# Altium project PCB_Project1.PrjPCB
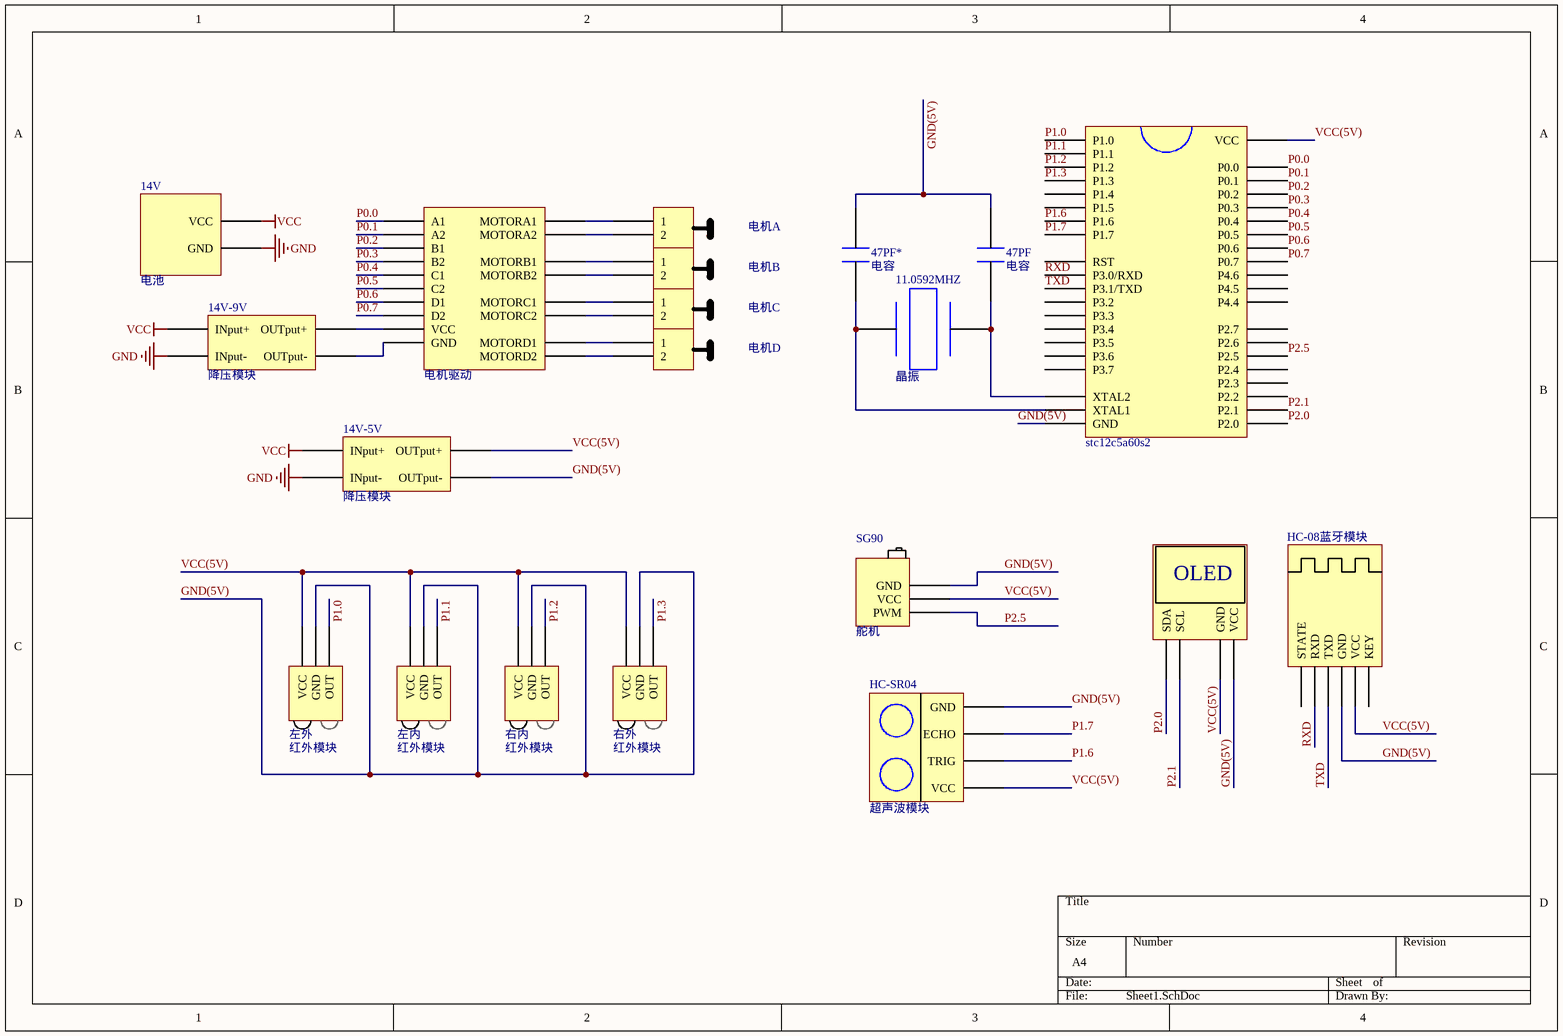
[diagram p0: Sheet1.SchDoc]
1 sheet, 20 parts. Net scope: global (net labels, ports and power ports of the same name join across sheets).

## Sheet Sheet1.SchDoc
size A4

### Parts
1  电机  (value not drawn)
2  电机  (value not drawn)
3  电机  (value not drawn)
4  电机  (value not drawn)
11.0592MHZ  晶振
14V  电池
14V-5V  降压模块
14V-9V  降压模块
47PF  电容
47PF*  电容
123412  电机驱动
HC-08蓝牙模块  蓝牙模块  (value not drawn)
HC-SR04  超声波模块
OLED  OLED显示屏  (value not drawn)
SG90  舵机
单片机  stc12c5a60s2
右内  红外模块
右外  红外模块
左内  红外模块
左外  红外模块

### Nets
GND: 14V.?2(GND) 14V-5V.?4(INput-) 14V-9V.?4(INput-)
VCC: 14V.?1(VCC) 14V-5V.?3(INput+) 14V-9V.?3(INput+)
GND(5V): 14V-5V.?2(OUTput-) 47PF.1 47PF*.1 HC-08蓝牙模块.?3(GND) HC-SR04.?4(GND) OLED.?3(VCC) SG90.?3(GND) 单片机.20(GND) 右内.?2(GND) 右外.?2(GND) 左内.?2(GND) 左外.?2(GND)
P0.0: 123412.?1(A1) 单片机.1(P0.0)
P0.1: 123412.?2(A2) 单片机.2(P0.1)
P0.2: 123412.?3(B1) 单片机.3(P0.2)
P0.3: 123412.?4(B2) 单片机.4(P0.3)
P0.4: 123412.?5(C1) 单片机.5(P0.4)
P0.5: 123412.?6(C2) 单片机.6(P0.5)
P0.6: 123412.?7(D1) 单片机.7(P0.6)
P0.7: 123412.?8(D2) 单片机.8(P0.7)
P1.0: 单片机.9(P1.0) 左外.?1(OUT)
P1.1: 单片机.10(P1.1) 左内.?1(OUT)
P1.2: 单片机.11(P1.2) 右内.?1(OUT)
P1.3: 单片机.12(P1.3) 右外.?1(OUT)
P1.6: HC-SR04.?2(TRIG) 单片机.15(P1.6)
P1.7: HC-SR04.?3(ECHO) 单片机.16(P1.7)
P2.0: OLED.?1(SDA) 单片机.32(P2.0)
P2.1: OLED.?2(SCL) 单片机.33(P2.1)
P2.5: SG90.?2(PWM) 单片机.37(P2.5)
RXD: HC-08蓝牙模块.?5(RXD) 单片机.30(P3.0/RXD)
TXD: HC-08蓝牙模块.?4(TXD) 单片机.29(P3.1/TXD)
VCC(5V): 14V-5V.?1(OUTput+) HC-08蓝牙模块.?2(VCC) HC-SR04.?1(VCC) OLED.?4(GND) SG90.?1(VCC) 单片机.18(VCC) 右内.?3(VCC) 右外.?3(VCC) 左内.?3(VCC) 左外.?3(VCC)
Net1_?1: 1.?1(1) 123412.?11(MOTORA1)
Net1_?2: 1.?2(2) 123412.?12(MOTORA2)
Net2_?1: 2.?1(1) 123412.?13(MOTORB1)
Net2_?2: 2.?2(2) 123412.?14(MOTORB2)
Net3_?1: 3.?1(1) 123412.?15(MOTORC1)
Net3_?2: 3.?2(2) 123412.?16(MOTORC2)
Net4_?1: 4.?1(1) 123412.?17(MOTORD1)
Net4_?2: 4.?2(2) 123412.?18(MOTORD2)
Net11.0592MHZ_1: 11.0592MHZ.1 47PF.2 单片机.18(XTAL2)
Net11.0592MHZ_2: 11.0592MHZ.2 47PF*.2 单片机.18(XTAL1)
Net14V-9V_?1: 14V-9V.?1(OUTput+) 123412.?9(VCC)
Net14V-9V_?2: 14V-9V.?2(OUTput-) 123412.?10(GND)

Not connected (* = marked no-connect by the designer): HC-08蓝牙模块 ?1(KEY) ?6(STATE); 单片机 13(P1.4) 14(P1.5) 19(RST) 23(P3.2) 24(P3.3) 25(P3.4) 26(P3.5) 27(P3.6) 28(P3.7) 31(P4.4) 34(P2.2) 35(P2.3) 36(P2.4) 38(P2.6) 39(P2.7) 40(P4.5)

### Notes on the sheet
- 电机A
- 电机B
- 电机C
- 电机D
- (near OLED) OLED